# Altium schematic sheet 12.SchDoc
size 297 x 209 mm
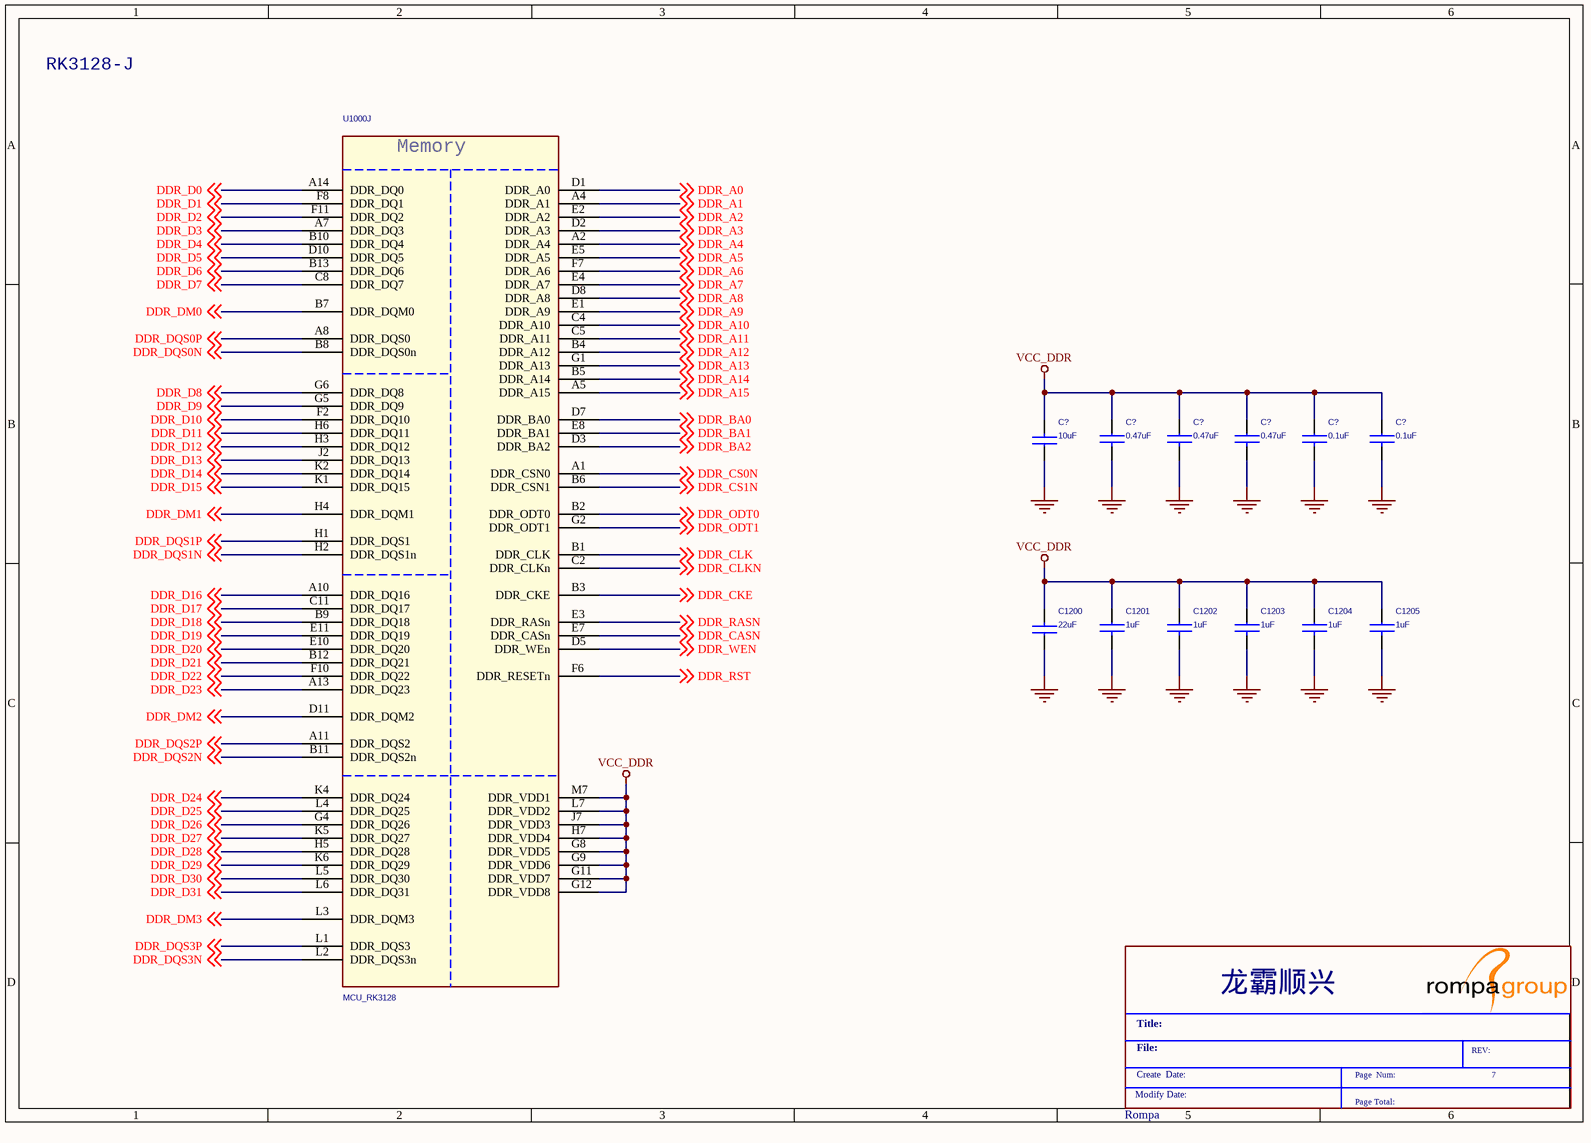
[diagram p0: 12.SchDoc]

## Parts
(Parts that share a designator on the sheet are numbered #1, #2 ... from top to bottom, then left to right.)
*  Rompa  Schematic Page Number: 7  (graphical)
C1200  22uF  [C0603]
C1201  1uF  [C0402]
C1202  1uF  [C0402]
C1203  1uF  [C0402]
C1204  1uF  [C0402]
C1205  1uF  [C0402]
C?#1  0.47uF  [C0402]
C?#2  0.47uF  [C0402]
C?#3  0.47uF  [C0402]
C?#4  0.1uF  [C0402]
C?#5  0.1uF  [C0402]
C?#6  10uF  [C0603]
U1000  MCU_RK3128  [BGA316-14X14-0.65]  (part J of 12)

## Nets
GND: C1200.1 C1201.2 C1202.2 C1203.2 C1204.2 C1205.2 C?#1.2 C?#2.2 C?#3.2 C?#4.2 C?#5.2 C?#6.1
VCC_DDR: C1200.2 C1201.1 C1202.1 C1203.1 C1204.1 C1205.1 C?#1.1 C?#2.1 C?#3.1 C?#4.1 C?#5.1 C?#6.2 U1000.G8(DDR_VDD5) U1000.G9(DDR_VDD6) U1000.G11(DDR_VDD7) U1000.G12(DDR_VDD8) U1000.H7(DDR_VDD4) U1000.J7(DDR_VDD3) U1000.L7(DDR_VDD2) U1000.M7(DDR_VDD1)
DDR_A0: U1000.D1(DDR_A0) ; off-sheet DDR_A0
DDR_A1: U1000.A4(DDR_A1) ; off-sheet DDR_A1
DDR_A2: U1000.E2(DDR_A2) ; off-sheet DDR_A2
DDR_A3: U1000.D2(DDR_A3) ; off-sheet DDR_A3
DDR_A4: U1000.A2(DDR_A4) ; off-sheet DDR_A4
DDR_A5: U1000.E5(DDR_A5) ; off-sheet DDR_A5
DDR_A6: U1000.F7(DDR_A6) ; off-sheet DDR_A6
DDR_A7: U1000.E4(DDR_A7) ; off-sheet DDR_A7
DDR_A8: U1000.D8(DDR_A8) ; off-sheet DDR_A8
DDR_A9: U1000.E1(DDR_A9) ; off-sheet DDR_A9
DDR_A10: U1000.C4(DDR_A10) ; off-sheet DDR_A10
DDR_A11: U1000.C5(DDR_A11) ; off-sheet DDR_A11
DDR_A12: U1000.B4(DDR_A12) ; off-sheet DDR_A12
DDR_A13: U1000.G1(DDR_A13) ; off-sheet DDR_A13
DDR_A14: U1000.B5(DDR_A14) ; off-sheet DDR_A14
DDR_A15: U1000.A5(DDR_A15) ; off-sheet DDR_A15
DDR_BA0: U1000.D7(DDR_BA0) ; off-sheet DDR_BA0
DDR_BA1: U1000.E8(DDR_BA1) ; off-sheet DDR_BA1
DDR_BA2: U1000.D3(DDR_BA2) ; off-sheet DDR_BA2
DDR_CASN: U1000.E7(DDR_CASn) ; off-sheet DDR_CASN
DDR_CKE: U1000.B3(DDR_CKE) ; off-sheet DDR_CKE
DDR_CLK: U1000.B1(DDR_CLK) ; off-sheet DDR_CLK
DDR_CLKN: U1000.C2(DDR_CLKn) ; off-sheet DDR_CLKN
DDR_CS0N: U1000.A1(DDR_CSN0) ; off-sheet DDR_CS0N
DDR_CS1N: U1000.B6(DDR_CSN1) ; off-sheet DDR_CS1N
DDR_D0: U1000.A14(DDR_DQ0) ; off-sheet DDR_D0
DDR_D1: U1000.F8(DDR_DQ1) ; off-sheet DDR_D1
DDR_D2: U1000.F11(DDR_DQ2) ; off-sheet DDR_D2
DDR_D3: U1000.A7(DDR_DQ3) ; off-sheet DDR_D3
DDR_D4: U1000.B10(DDR_DQ4) ; off-sheet DDR_D4
DDR_D5: U1000.D10(DDR_DQ5) ; off-sheet DDR_D5
DDR_D6: U1000.B13(DDR_DQ6) ; off-sheet DDR_D6
DDR_D7: U1000.C8(DDR_DQ7) ; off-sheet DDR_D7
DDR_D8: U1000.G6(DDR_DQ8) ; off-sheet DDR_D8
DDR_D9: U1000.G5(DDR_DQ9) ; off-sheet DDR_D9
DDR_D10: U1000.F2(DDR_DQ10) ; off-sheet DDR_D10
DDR_D11: U1000.H6(DDR_DQ11) ; off-sheet DDR_D11
DDR_D12: U1000.H3(DDR_DQ12) ; off-sheet DDR_D12
DDR_D13: U1000.J2(DDR_DQ13) ; off-sheet DDR_D13
DDR_D14: U1000.K2(DDR_DQ14) ; off-sheet DDR_D14
DDR_D15: U1000.K1(DDR_DQ15) ; off-sheet DDR_D15
DDR_D16: U1000.A10(DDR_DQ16) ; off-sheet DDR_D16
DDR_D17: U1000.C11(DDR_DQ17) ; off-sheet DDR_D17
DDR_D18: U1000.B9(DDR_DQ18) ; off-sheet DDR_D18
DDR_D19: U1000.E11(DDR_DQ19) ; off-sheet DDR_D19
DDR_D20: U1000.E10(DDR_DQ20) ; off-sheet DDR_D20
DDR_D21: U1000.B12(DDR_DQ21) ; off-sheet DDR_D21
DDR_D22: U1000.F10(DDR_DQ22) ; off-sheet DDR_D22
DDR_D23: U1000.A13(DDR_DQ23) ; off-sheet DDR_D23
DDR_D24: U1000.K4(DDR_DQ24) ; off-sheet DDR_D24
DDR_D25: U1000.L4(DDR_DQ25) ; off-sheet DDR_D25
DDR_D26: U1000.G4(DDR_DQ26) ; off-sheet DDR_D26
DDR_D27: U1000.K5(DDR_DQ27) ; off-sheet DDR_D27
DDR_D28: U1000.H5(DDR_DQ28) ; off-sheet DDR_D28
DDR_D29: U1000.K6(DDR_DQ29) ; off-sheet DDR_D29
DDR_D30: U1000.L5(DDR_DQ30) ; off-sheet DDR_D30
DDR_D31: U1000.L6(DDR_DQ31) ; off-sheet DDR_D31
DDR_DM0: U1000.B7(DDR_DQM0) ; off-sheet DDR_DM0
DDR_DM1: U1000.H4(DDR_DQM1) ; off-sheet DDR_DM1
DDR_DM2: U1000.D11(DDR_DQM2) ; off-sheet DDR_DM2
DDR_DM3: U1000.L3(DDR_DQM3) ; off-sheet DDR_DM3
DDR_DQS0N: U1000.B8(DDR_DQS0n) ; off-sheet DDR_DQS0N
DDR_DQS0P: U1000.A8(DDR_DQS0) ; off-sheet DDR_DQS0P
DDR_DQS1N: U1000.H2(DDR_DQS1n) ; off-sheet DDR_DQS1N
DDR_DQS1P: U1000.H1(DDR_DQS1) ; off-sheet DDR_DQS1P
DDR_DQS2N: U1000.B11(DDR_DQS2n) ; off-sheet DDR_DQS2N
DDR_DQS2P: U1000.A11(DDR_DQS2) ; off-sheet DDR_DQS2P
DDR_DQS3N: U1000.L2(DDR_DQS3n) ; off-sheet DDR_DQS3N
DDR_DQS3P: U1000.L1(DDR_DQS3) ; off-sheet DDR_DQS3P
DDR_ODT0: U1000.B2(DDR_ODT0) ; off-sheet DDR_ODT0
DDR_ODT1: U1000.G2(DDR_ODT1) ; off-sheet DDR_ODT1
DDR_RASN: U1000.E3(DDR_RASn) ; off-sheet DDR_RASN
DDR_RST: U1000.F6(DDR_RESETn) ; off-sheet DDR_RST
DDR_WEN: U1000.D5(DDR_WEn) ; off-sheet DDR_WEN

## Notes on the sheet
- RK3128-J
- (in symbol MCU_RK3128, part J) Memory
- (in symbol Rompa) 龙霸顺兴; Title:; File:; REV:; Create  Date:; Page  Num:; Modify Date:; Page Total:

## Library data of the parts
C1200 = CAP NP: RoHS CHIP CAP 22uF +10/-10% X5R
C1201-C1205 C?#1-C?#5 = CAP NP_0
C?#6 = CAP NP: RoHS CHIP CAP 10uF +10/-10% X5R